# EAGLE schematic riffleito-xbee (EAGLE 6.5.0)
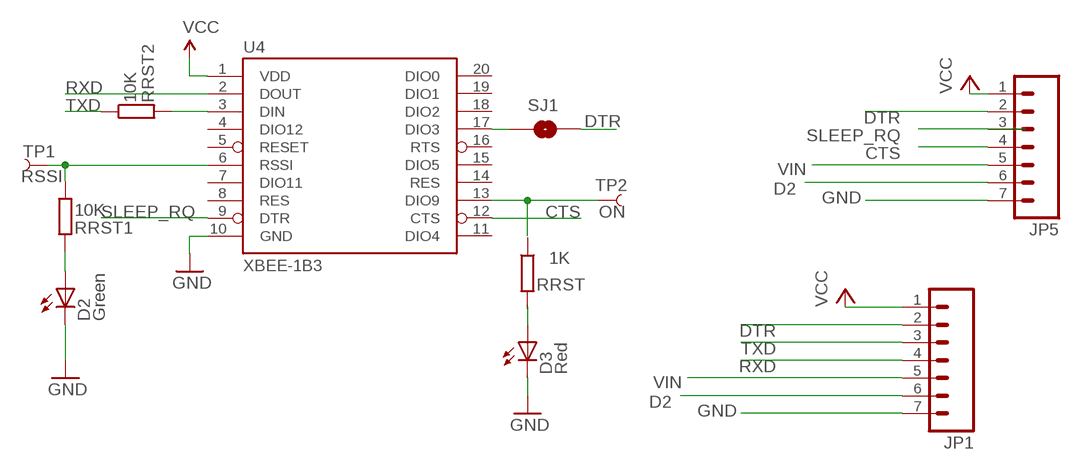
[diagram p0: schematic, sheet 1]

## Parts
D2  Green  LED0603  [LED-0603]
D3  Red  LED0603  [LED-0603]
JP1  M07  [1X07]
JP5  M07  [1X07]
RRST  1K  R-EU_R0805  [R0805]
RRST1  10K  R-EU_R0805  [R0805]
RRST2  10K  R-EU_R0805  [R0805]
SJ1  SOLDERJUMPERNC  [SJ_2S]
TP1  RSSI  TEST-POINT3X5  [PAD.03X.05]
TP2  ON  TEST-POINT3X5  [PAD.03X.05]
U4  XBEE-1B3  [XBEE-SMD]

## Nets
CTS: JP5.4 U4.12(CTS)
D2: JP1.6 JP5.6
DTR: JP1.2 JP5.2 SJ1.2
GND: D2.C D3.C JP1.7 JP5.7 U4.10(GND)
N$1: TP2.P$1 U4.13(DIO9)
N$3: D2.A RRST1.2
N$4: RRST1.1 TP1.P$1 U4.6(RSSI)
N$6: D3.A RRST.2
N$7: RRST2.2 U4.3(DIN)
N$13: SJ1.1 U4.17(DIO3)
RXD: JP1.4 U4.2(DOUT)
SLEEP_RQ: JP5.3 U4.9(DTR)
TXD: JP1.3 RRST2.1
VCC [power]: JP1.1 JP5.1 U4.1(VDD)
VIN [power]: JP1.5 JP5.5
Unconnected: RRST.1 U4.4(DIO12) U4.5(RESET) U4.7(DIO11) U4.8(RES) U4.11(DIO4) U4.14(RES) U4.15(DIO5) U4.16(RTS) U4.18(DIO2) U4.19(DIO1) U4.20(DIO0)

## Library data of the parts
D2 D3 = SparkFun:LED: LEDs Standard schematic elements and footprints for 5mm, 3mm, 1206, and 0603 sized LEDs. 5mm - Spark Fun Electronics SKU : COM-00529 (and others)
JP1 JP5 = SparkFun-Connectors:M07: Header 7 Standard 7-pin 0.1" header. Use with straight break away headers (SKU : PRT-00116), right angle break away headers (PRT-00553), swiss pins (PRT-00743), machine pins (PRT-00117), and female headers (PRT-00115). NOTES ON THE VARIANTS LOCK and LOCK_LONGPADS... This footprint was designed to help hold the alignment of a through-hole component (i.e. 7-pin header) while soldering it into place. You may notice that each hole has been shifted either up or down by 0.005 of an inch from it's more standard position (which is usually a perfectly straight line). This slight alteration caused the pins (the squares in the middle) to touch the edges of the holes. Because they are alternating, it causes a "brace" to hold the header in place. 0.005 has proven to be the perfect amount of "off-center" position when using our standard breakaway headers. Although looks a little odd when you look at the bare footprint, once you have a header in there, the alteration is very hard to notice. Also, if you push a header all the way into place, it is covered up entirely on the bottom side. This idea of altering the position of holes to aid alignment will be further integrated into the Sparkfun Library for other footprints. It can help hold any component with 3 or more connection pins.
RRST RRST1 RRST2 = rcl:R-EU_: RESISTOR, European symbol
SJ1 = SparkFun:SOLDERJUMPER: Solder Jumper Standard SMD solder jumper. Used to automate production. Two varients : Normally Open and Normally Closed are the same, but have different paste layers. NC will have a large amount of paste and should jumper during reflow.
TP1 TP2 = SparkFun:TEST-POINT
U4 = SparkFun:XBEE-1

## Net classes
0 default: width 0.203 mm, drill 0.33 mm, clearance 0.203 mm
1 power: width 0.381 mm, drill 0.33 mm, clearance 0.254 mm